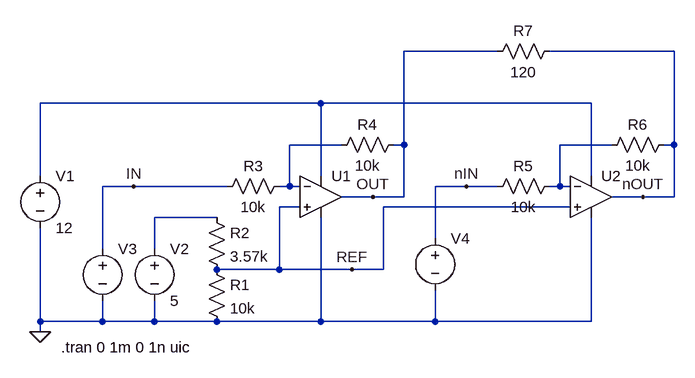
[diagram p0: schematic excitation_amplifier.asc]
excitation_amplifier.asc, the LTspice schematic file:
Version 4
SHEET 1 880 680
WIRE 480 -48 336 -48
WIRE 752 -48 560 -48
WIRE 208 32 -224 32
WIRE 624 32 208 32
WIRE 240 96 160 96
WIRE 336 96 336 -48
WIRE 336 96 320 96
WIRE 656 96 576 96
WIRE 752 96 752 -48
WIRE 752 96 736 96
WIRE -224 144 -224 32
WIRE 208 144 208 32
WIRE 624 144 624 32
WIRE -80 160 -128 160
WIRE 64 160 -80 160
WIRE 160 160 160 96
WIRE 160 160 144 160
WIRE 176 160 160 160
WIRE 432 160 384 160
WIRE 480 160 432 160
WIRE 576 160 576 96
WIRE 576 160 560 160
WIRE 592 160 576 160
WIRE 288 176 240 176
WIRE 336 176 336 96
WIRE 336 176 288 176
WIRE 704 176 656 176
WIRE 752 176 752 96
WIRE 752 176 704 176
WIRE 176 192 144 192
WIRE 592 192 304 192
WIRE 48 208 -48 208
WIRE 384 240 384 160
WIRE -128 256 -128 160
WIRE -48 256 -48 208
WIRE 144 288 144 192
WIRE 144 288 48 288
WIRE 256 288 144 288
WIRE 304 288 304 192
WIRE 304 288 256 288
WIRE -224 368 -224 224
WIRE -128 368 -128 336
WIRE -128 368 -224 368
WIRE -48 368 -48 336
WIRE -48 368 -128 368
WIRE 48 368 -48 368
WIRE 208 368 208 208
WIRE 208 368 48 368
WIRE 384 368 384 320
WIRE 384 368 208 368
WIRE 624 368 624 208
WIRE 624 368 384 368
WIRE -224 384 -224 368
FLAG -224 384 0
FLAG 288 176 OUT
FLAG -80 160 IN
FLAG 704 176 nOUT
FLAG 256 288 REF
FLAG 432 160 nIN
SYMBOL OpAmps\\UniversalOpAmp2 208 176 R0
SYMATTR InstName U1
SYMATTR Value2 Avol=1Meg GBW=24Meg Slew=35Meg
SYMATTR SpiceLine Ilimit=125m Rail=0 Vos=0
SYMBOL voltage -224 128 R0
WINDOW 123 0 0 Left 0
WINDOW 39 0 0 Left 0
SYMATTR InstName V1
SYMATTR Value 12
SYMBOL voltage -48 240 R0
WINDOW 123 0 0 Left 0
WINDOW 39 0 0 Left 0
SYMATTR InstName V2
SYMATTR Value 5
SYMBOL res 32 272 R0
SYMATTR InstName R1
SYMATTR Value 10k
SYMBOL res 32 192 R0
SYMATTR InstName R2
SYMATTR Value 3.57k
SYMBOL res 160 144 R90
WINDOW 0 0 56 VBottom 2
WINDOW 3 32 56 VTop 2
SYMATTR InstName R3
SYMATTR Value 10k
SYMBOL res 224 112 R270
WINDOW 0 32 56 VTop 2
WINDOW 3 0 56 VBottom 2
SYMATTR InstName R4
SYMATTR Value 10k
SYMBOL voltage -128 240 R0
WINDOW 3 24 96 Invisible 2
WINDOW 123 0 0 Left 0
WINDOW 39 0 0 Left 0
SYMATTR InstName V3
SYMATTR Value SINE(2.47 1.8 20k)
SYMBOL OpAmps\\UniversalOpAmp2 624 176 R0
SYMATTR InstName U2
SYMATTR Value2 Avol=1Meg GBW=24Meg Slew=35Meg
SYMATTR SpiceLine Ilimit=125m Rail=0 Vos=0
SYMBOL voltage 384 224 R0
WINDOW 3 24 96 Invisible 2
WINDOW 123 0 0 Left 0
WINDOW 39 0 0 Left 0
SYMATTR InstName V4
SYMATTR Value SINE(2.47 1.8 20k 0 0 180)
SYMBOL res 576 144 R90
WINDOW 0 0 56 VBottom 2
WINDOW 3 32 56 VTop 2
SYMATTR InstName R5
SYMATTR Value 10k
SYMBOL res 752 80 R90
WINDOW 0 0 56 VBottom 2
WINDOW 3 32 56 VTop 2
SYMATTR InstName R6
SYMATTR Value 10k
SYMBOL res 576 -64 R90
WINDOW 0 0 56 VBottom 2
WINDOW 3 32 56 VTop 2
SYMATTR InstName R7
SYMATTR Value 120
TEXT -192 408 Left 2 !.tran 0 1m 0 1n uic

The netlist it stands for:
* excitation_amplifier.asc
XU1 REF N002 N001 0 OUT level2 Avol=1Meg GBW=24Meg Slew=35Meg Ilimit=125m Rail=0 Vos=0 En=0 Enk=0 In=0 Ink=0 Rin=500Meg  ; pins In+ In- V+ V- OUT
V1 N001 0 12
V2 N004 0 5
R1 REF 0 10k
R2 N004 REF 3.57k
R3 N002 IN 10k
R4 N002 OUT 10k
V3 IN 0 SINE(2.47 1.8 20k)
XU2 REF N003 N001 0 nOUT level2 Avol=1Meg GBW=24Meg Slew=35Meg Ilimit=125m Rail=0 Vos=0 En=0 Enk=0 In=0 Ink=0 Rin=500Meg  ; pins In+ In- V+ V- OUT
V4 nIN 0 SINE(2.47 1.8 20k 0 0 180)
R5 N003 nIN 10k
R6 nOUT N003 10k
R7 nOUT OUT 120
.tran 0 1m 0 1n uic
.lib UniversalOpAmp2.lib
.backanno
.end